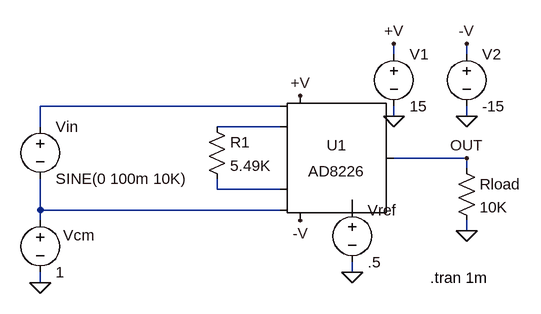
[diagram p0: schematic AD8226.asc]
AD8226.asc, the LTspice schematic file:
Version 4
SHEET 1 1240 700
WIRE 640 -1264 640 -1280
WIRE 752 -1264 752 -1280
WIRE 464 -1184 96 -1184
WIRE 640 -1168 640 -1184
WIRE 752 -1168 752 -1184
WIRE 96 -1152 96 -1184
WIRE 464 -1152 368 -1152
WIRE 752 -1104 640 -1104
WIRE 752 -1088 752 -1104
WIRE 368 -1056 368 -1072
WIRE 464 -1056 368 -1056
WIRE 96 -1024 96 -1072
WIRE 464 -1024 96 -1024
WIRE 576 -1024 576 -1040
WIRE 96 -1008 96 -1024
WIRE 752 -992 752 -1008
WIRE 576 -928 576 -944
WIRE 96 -912 96 -928
FLAG 640 -1280 +V
FLAG 640 -1168 0
FLAG 752 -1104 OUT
FLAG 496 -1200 +V
FLAG 752 -1280 -V
FLAG 496 -1008 -V
FLAG 752 -992 0
FLAG 752 -1168 0
FLAG 96 -912 0
FLAG 576 -928 0
SYMBOL voltage 640 -1280 R0
WINDOW 123 0 0 Left 2
WINDOW 39 0 0 Left 2
SYMATTR InstName V1
SYMATTR Value 15
SYMBOL voltage 96 -1168 R0
WINDOW 123 24 146 Left 2
WINDOW 39 24 125 Left 2
SYMATTR InstName Vin
SYMATTR Value SINE(0 100m 10K)
SYMBOL res 352 -1168 R0
SYMATTR InstName R1
SYMATTR Value 5.49K
SYMBOL voltage 752 -1280 R0
WINDOW 123 24 146 Left 2
WINDOW 39 24 125 Left 2
SYMATTR InstName V2
SYMATTR Value -15
SYMBOL res 736 -1104 R0
SYMATTR InstName Rload
SYMATTR Value 10K
SYMBOL voltage 96 -1024 R0
WINDOW 123 0 0 Left 2
WINDOW 39 0 0 Left 2
WINDOW 0 35 39 Left 2
SYMATTR InstName Vcm
SYMATTR Value 1
SYMBOL voltage 576 -1040 R0
WINDOW 123 24 132 Left 2
WINDOW 39 24 114 Left 2
SYMATTR InstName Vref
SYMATTR Value .5
SYMBOL AD8226 496 -1104 R0
SYMATTR InstName U1
TEXT 696 -920 Left 2 !.tran 1m

The netlist it stands for:
* AD8226.asc
V1 +V 0 15
Vin N001 N004 SINE(0 100m 10K)
R1 N002 N003 5.49K
V2 -V 0 -15
Rload OUT 0 10K
Vcm N004 0 1
Vref N005 0 .5
XU1 N004 N002 N003 N001 -V N005 OUT +V AD8226
.tran 1m
.lib ADI1.lib
.backanno
.end